# Altium schematic sheet GPS_POWER.SchDoc
size A3; DocumentNumber: 1; SheetNumber: 1; SheetTotal: 2
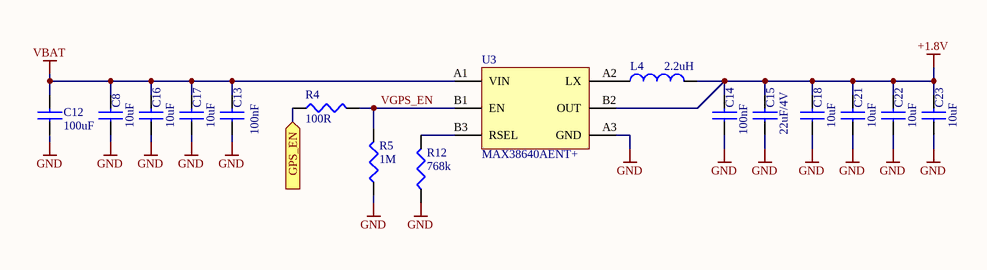
[diagram p0: GPS_POWER.SchDoc]

## Parts
C8  10uF  [CAP0603]
C12  100uF  [CAP0805]
C13  100nF  [CAP0402]
C14  100nF  [CAP0402]
C15  22uF/4V  [CAP0603]
C16  10uF  [CAP0603]
C17  10uF  [CAP0603]
C18  10uF  [CAP0603]
C21  10uF  [CAP0603]
C22  10uF  [CAP0603]
C23  10uF  [CAP0603]
L4  2.2uH  [IND2.3X1.7]
R4  100R  [RES0402]
R5  1M  [RES0402]
R12  768k  [RES0603]
U3  MAX38640AENT+  [WLP-6]

## Ports
GPS_EN (in)

## Nets
+1.8V: C14.2 C15.2 C18.2 C21.2 C22.2 C23.2 L4.2 U3.B2(OUT)
GND: C8.1 C12.1 C13.1 C14.1 C15.1 C16.1 C17.1 C18.1 C21.1 C22.1 C23.1 R5.1 R12.1 U3.A3(GND)
VBAT: C8.2 C12.2 C13.2 C16.2 C17.2 U3.A1(VIN)
GPS_EN: R4.1 ; port GPS_EN
VGPS_EN: R4.2 R5.2 U3.B1(EN)
NetL4_1: L4.1 U3.A2(LX)
NetR12_2: R12.2 U3.B3(RSEL)

## Notes on the sheet
- Size: A3
- Revision:
- Sheet
- of

## Library data of the parts
C8 C16-C18 C21-C23 = C - 10uF/10V: Cap Ceramic 10uF 10V X5R 10% SMD 0603 85C Paper T/R; Manufacturer: Samsung; Manufacturer Part Number: CL10A106KP8NNNC; IRNAS Part No.: /; Stock 1: 2844657; Pricing 1: 1=0.36, 10=0.248, 100=0.1403, 500=0.099, 1000=0.08663 (USD); Mount: Surface Mount; Case/Package: 0603; Case Code (Metric): 1608; Case Code (Imperial): 0603; Material: Ceramic; Contact Plating: Tin; Min Operating Temperature: -55°C; Max Operating Temperature: 85°C; Capacitance: 10uF; Tolerance: 10%; Package Quantity: 1; Packaging: Tape and Reel; Voltage Rating: 10V; Dielectric: X5R; Voltage Rating (DC): 10V; Length: 1.6mm; Height: 0.8mm; Width: 0.031inch; Thickness: 0.035inch; Depth: 0.8mm; Radiation Hardening: No; Lead Free: Lead Free; ComponentLink1URL: https://www.verical.com/server-webapp/html/getDatasheet?partID=359551; ComponentLink1Description: https://www.verical.com/server-webapp/html/getDatasheet?partID=359551; ComponentLink2URL: http://www1.futureelectronics.com/doc/SAMSUNG%20PASSIVE/CL05B104KQ5NNNC.pdf; ComponentLink2Description: http://www1.futureelectronics.com/doc/SAMSUNG%20PASSIVE/CL05B104KQ5NNNC.pdf; ComponentLink3URL: https://produktinfo.conrad.com/datenblaetter/450000-474999/457369-da-01-en-VS_KONDENSATOR_0603.pdf; ComponentLink3Description: https://produktinfo.conrad.com/datenblaetter/450000-474999/457369-da-01-en-VS_KONDENSATOR_0603.pdf; Supplier 1: Farnell; Supplier Part Number 1: 2456110
C12 = C - 100uF/0805: Multilayer Ceramic Capacitors MLCC - SMD/SMT 0805 100uF 4volts *Derate Voltage/Temp; Manufacturer: Murata; Manufacturer Part Number: GRM21BR60G107ME15L; IRNAS Part No.: /; Tolerance: 20%; Dielectric: X5R; Voltage Rating (DC): 4V; Dissipation Factor: 0.1%; Supplier 1: Farnell; Stock 1: 529; Pricing 1: 5=0.775, 50=0.463, 250=0.405, 500=0.289, 1500=0.243, 3000=0.229, 15000=0.21 (GBP); Mount: Surface Mount; Case/Package: 0805; Weight: 0.000335oz; Case Code (Metric): 2012; Case Code (Imperial): 0805; Dielectric Material: Ceramic; Min Operating Temperature: -55°C; Max Operating Temperature: 85°C; Packaging: Tape and Reel; Voltage Rating: 4V; Voltage: 4V; Termination: SMD/SMT; Package Quantity: 3000; Capacitance: 100uF; Length: 2mm; Height: 1.25mm; Width: 0.049inch; Thickness: 0.057inch; Depth: 1.25mm; REACH SVHC: No SVHC; Lead Free: Lead Free; ComponentLink1URL: http://www.farnell.com/datasheets/2079181.pdf; ComponentLink1Description: http://www.farnell.com/datasheets/2079181.pdf; ComponentLink2URL: http://search.murata.co.jp/Ceramy/image/img/A01X/partnumbering_e_01.pdf; ComponentLink2Description: http://search.murata.co.jp/Ceramy/image/img/A01X/partnumbering_e_01.pdf; ComponentLink3URL: http://psearch.en.murata.com/capacitor/product/GRM21BR60G107ME15%23.pdf; ComponentLink3Description: http://psearch.en.murata.com/capacitor/product/GRM21BR60G107ME15%23.pdf; ComponentLink4URL: http://www.mouser.com/ds/2/281/c02e-2905.pdf; ComponentLink4Description: http://www.mouser.com/ds/2/281/c02e-2905.pdf; Supplier Part Number 1: 2611937
C13 C14 = C - 100nF/0402: MULTICOMP         MC0402X104J160CT             SMD Multilayer Ceramic Capacitor, 0402 [1005 Metric], 0.1 F, 16 V,  5%, X5R, MC Series                          New; IRNAS Part No.: /; Voltage Rating: 16V; Supplier 1: Farnell; Manufacturer: Multicomp; Manufacturer Part Number: MC0402X104J160CT; Stock 1: 3230; Pricing 1: 10=0.0139, 100=0.0108, 500=0.0076, 2500=0.0051, 5000=0.0038 (EUR); Case Code (Metric): 1005; Case Code (Imperial): 0402; Min Operating Temperature: -55°C; Max Operating Temperature: 85°C; Capacitance: 100nF; Dielectric: X5R; Packaging: Tape and Reel; Tolerance: 5%; Voltage Rating (DC): 16V; REACH SVHC: No SVHC; ComponentLink1URL: http://www.farnell.com/datasheets/2117933.pdf; ComponentLink1Description: http://www.farnell.com/datasheets/2117933.pdf; ComponentLink2URL: http://www.farnell.com/datasheets/2117900.pdf; ComponentLink2Description: http://www.farnell.com/datasheets/2117900.pdf; Supplier Part Number 1: 2627419
C15 = C - 10uF/10V: SMD Multilayer Ceramic Capacitor, 22 µF, 4 V, 0603 [1608 Metric], ± 20%, X5R, GRM Series; Manufacturer: Samsung; Manufacturer Part Number: GRM188R60G226MEA0D; IRNAS Part No.: /; Capacitance: 10uF; Tolerance: 10%; Voltage Rating: 10V; Stock 1: 2844657; Pricing 1: 1=0.36, 10=0.248, 100=0.1403, 500=0.099, 1000=0.08663 (USD); Mount: Surface Mount; Case/Package: 0603; Case Code (Metric): 1608; Case Code (Imperial): 0603; Material: Ceramic; Contact Plating: Tin; Min Operating Temperature: -55°C; Max Operating Temperature: 85°C; Package Quantity: 1; Packaging: Tape and Reel; Dielectric: X5R; Voltage Rating (DC): 10V; Length: 1.6mm; Height: 0.8mm; Width: 0.031inch; Thickness: 0.035inch; Depth: 0.8mm; Radiation Hardening: No; Lead Free: Lead Free; ComponentLink1URL: https://www.verical.com/server-webapp/html/getDatasheet?partID=359551; ComponentLink1Description: https://www.verical.com/server-webapp/html/getDatasheet?partID=359551; ComponentLink2URL: http://www1.futureelectronics.com/doc/SAMSUNG%20PASSIVE/CL05B104KQ5NNNC.pdf; ComponentLink2Description: http://www1.futureelectronics.com/doc/SAMSUNG%20PASSIVE/CL05B104KQ5NNNC.pdf; ComponentLink3URL: https://produktinfo.conrad.com/datenblaetter/450000-474999/457369-da-01-en-VS_KONDENSATOR_0603.pdf; ComponentLink3Description: https://produktinfo.conrad.com/datenblaetter/450000-474999/457369-da-01-en-VS_KONDENSATOR_0603.pdf; Supplier 1: Farnell; Supplier Part Number 1: 1907502
L4 = L - 2.2 uH 900mA: Manufacturer: Bourns; Manufacturer Part Number: SRN2009T-2R2M; IRNAS Part No.: /; Supplier 1: Farnell; Stock 1: 1975; Pricing 1: 5=0.308, 50=0.201, 250=0.163, 500=0.145, 1000=0.133, 2000=0.124, 10000=0.116 (EUR); Supplier Part Number 1: 2808272
R4 = R - 100R/0402: MULTICOMP         MCMR04X1000FTL            SMD Chip Resistor, Ceramic, MCMR Series, 100 ohm, 50 V, 0402 [1005 Metric], 62.5 mW,  1%; IRNAS Part No.: /; Temperature Coefficient: 100ppm/°C; Power Rating: 62.5mW; Voltage Rating: 50V; Supplier 1: Farnell; Manufacturer: Multicomp; Manufacturer Part Number: MCMR04X1000FTL; Stock 1: 62365; Pricing 1: 10=0.0071, 100=0.0042, 500=0.003, 2500=0.0024, 5000=0.0019 (GBP); Case/Package: 0402; Case Code (Metric): 1005; Case Code (Imperial): 0402; Resistance: 100R; Tolerance: 1%; Composition: Ceramic; Packaging: Cut Tape; Voltage Rating (DC): 50V; REACH SVHC: No SVHC; ComponentLink1URL: https://datasheet.ciiva.com/28692/1716705-28692087.pdf; ComponentLink1Description: https://datasheet.ciiva.com/28692/1716705-28692087.pdf; ComponentLink2URL: https://datasheet.ciiva.com/22708/1716705-22708156.pdf; ComponentLink2Description: https://datasheet.ciiva.com/22708/1716705-22708156.pdf; Supplier Part Number 1: 2072515
R5 = R - 1M/0402: MCMR04X1004FTL RES, 1M, 1%, 0.0625W, 0402, THICK FILM; Manufacturer: MULTICOMP; Manufacturer Part Number: MC0063W060311M; IRNAS Part No.: I-100012; Resistance: 1; Voltage Rating: 50; Resistor Case Style: 0603 [1608 Metric]; Power Rating: 63; Product Range: MC Series; Temperature Coefficient: ± 100; SVHC: No SVHC (17-Dec-2015); External Depth: 0.45; External Length / Height: 1.6; External Width: 0.8; No. of Pins: 2; Reel Quantity: 5000; Resistor Mounting: Surface Mount Device; Temperature Coeff. +: 100; Voltage Rating V DC: 50V<!--FANDB--><div class="features-and-benefits-container"><div class="features-and-benefits-description"><span class="features-benefits-value">The Multicomp MC series current sense resistors are thick film chip resistors. The resistance range includes E96 and E24 decade values from 1ohm to 10Mohm.</span></div><div class="features-and-benefits-list"><ul class="features-and-benefits-list-list"><li class="features-and-benefits-list-item">EIA 0402, 0603, 0805, 1206 chip sizes available</li><li class="features-and-benefits-list-item">Small size and low weight</li><li class="features-and-benefits-list-item">Suitable for both wave and reflow soldering</li><li class="features-and-benefits-list-item">Reduction of assembly costs</li><li class="features-and-benefits-list-item">Maximum working voltage of 50V(0402, 0603), 150V(0805), 200V(1206)</li><li class="features-and-benefits-list-item">Available in ±1%, ±2% and ±5% tolerance</li><li class="features-and-benefits-list-item">Power rating of 62.5mW, 100mW and 125mW</li><li class="features-and-benefits-list-item">±400ppm/°C(1ohm to 10ohm), ±200ppm/°C(11ohm to 100ohm), ±100; Supplier 1: Farnell; RoHS: Y-EX; Stock 1: 333415; Pricing 1: 10=0.0011, 100=0.001, 500=0.0009, 1000=0.0008, 2500=0.0007 (GBP); Resistance Tolerance: ± 1%; Packaging: Cut Tape; Resistor Element Material: Thick Film; Automotive Qualification Standard: -; Operating Temperature Max: 155; Operating Temperature Min: -55; Operating Temperature Range: -55°C to +155; Tape Width: 8; Temperature Coeff. -: 100; Tolerance +: 1%; Tolerance -: 1%; ComponentLink1URL: http://www.farnell.com/datasheets/1788326.pdf; ComponentLink1Description: http://www.farnell.com/datasheets/1788326.pdf; ComponentLink2URL: http://www.farnell.com/cad/1558928.zip; ComponentLink2Description: http://www.farnell.com/cad/1558928.zip; Supplier Part Number 1: 9330410
R12 = R - 768k/0402: SMD Chip Resistor, 0402 [1005 Metric], 768 kohm, WR04 Series, 50 V, Thick Film, 62.5 mW; Manufacturer: Vishay; IRNAS Part No.: /; Tolerance: 1%; Power Rating: 100mW; Voltage Rating: 75V; Temperature Coefficient: 100ppm/°C; Stock 1: 18827; Pricing 1: 10=0.0242, 100=0.0169, 500=0.0125, 1000=0.0073, 2500=0.0057 (EUR); Case/Package: 0603; Number of Pins: 2; Weight: 7.1E-05oz; Case Code (Metric): 1608; Case Code (Imperial): 0603; Contact Plating: Tin; Min Operating Temperature: -55°C; Max Operating Temperature: 155°C; Packaging: Tape and Reel; Package Quantity: 10; Termination: SMD/SMT; Resistance: 768k; Composition: Thick Film; Number of Terminations: 2; Military Standard: Not; Max Power Dissipation: 100mW; Voltage Rating (DC): 75V; Working Voltage: 75V; Length: 1.55mm; Height: 0.45mm; Width: 0.033inch; Depth: 0.85mm; Radiation Hardening: No; REACH SVHC: Unknown; Lead Free: Lead Free; ComponentLink1URL: http://www.farnell.com/datasheets/1960319.pdf?_ga=2.20359096.1822379758.1564985606-1373726713.1554121096&_gac=1.128519550.1562763802.CjwKCAjwmZbpBRAGEiwADrmVXm8xT8OHDZvJe8qZIQyyGmIuiUD-TEITatw0hIdDkyBwIXXCH7oneRoCl7cQAvD_BwE; ComponentLink1Description: Datasheet; Supplier 1: Farnell; Supplier Part Number 1: 2670555
U3 = V_SW - MAX38640AENT+: Switching Voltage Regulators Tiny 300nA nanoPower Buck converters in uDFN and WLP pacakges; Manufacturer: ROHM; Manufacturer Part Number: BD70522GUL; Topology: Buck (Step Down); Input Voltage Min: 4.5; Input Voltage Max: 45; No. of Outputs: 1; DC / DC Converter IC Case: TO-263; No. of Pins: 5; Output Current: 3; Output Voltage Min: 1.23; Output Voltage Max: 37; Switching Frequency: 150; SVHC: No SVHC (12-Jan-2017; RoHS: YES; Operating Temperature Max: 125; Packaging: Each; Product Range: -; Automotive Qualification Standard: -; MSL: MSL 1 - Unlimited; ComponentLink1Description: Datasheet; ComponentLink1URL: https://eu.mouser.com/datasheet/2/256/MAX38640A-MAX38643B-1516623.pdf; Supplier 1: Mouser; Supplier Part Number 1: 700-MAX38640AENT+